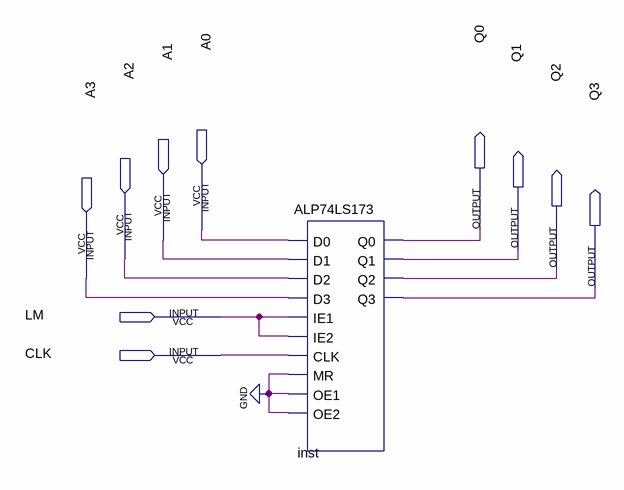
[diagram p0: schematic sheet]
// Quartus schematic REM.bdf as structural Verilog: 1 symbols, 10 pins
module REM (
  input  A0,
  input  A1,
  input  A2,
  input  A3,
  input  LM,
  input  CLK,
  output Q0,
  output Q1,
  output Q2,
  output Q3
);

  ALP74LS173 inst (
    .D0(A0), .D1(A1), .D2(A2), .D3(A3), .IE1(LM), .IE2(LM), .MR(1'b0), .OE1(1'b0), .OE2(1'b0), .CP(CLK),
    .Q0(Q0), .Q1(Q1), .Q2(Q2), .Q3(Q3));
endmodule
